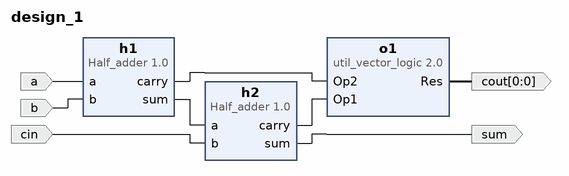
[diagram p0: block diagram of the top level]
# Vivado block design design_1, xc7a100tcsg324-1, Vivado 2024.1
create_bd_design design_1

create_bd_port -dir I a
create_bd_port -dir I b
create_bd_port -dir I cin
create_bd_port -dir O sum
create_bd_port -dir O -from 0 -to 0 cout

create_bd_cell -type ip -vlnv xilinx.com:user:Half_adder:1.0 h1
create_bd_cell -type ip -vlnv xilinx.com:user:Half_adder:1.0 h2
create_bd_cell -type ip -vlnv xilinx.com:ip:util_vector_logic:2.0 o1
set_property -dict {CONFIG.C_OPERATION or CONFIG.C_SIZE 1} [get_bd_cells o1]

# ---- connections ----

connect_bd_net -net Half_adder_0_carry [get_bd_pins h1/carry] [get_bd_pins o1/Op2]
connect_bd_net -net Half_adder_0_sum [get_bd_pins h1/sum] [get_bd_pins h2/a]
connect_bd_net -net Half_adder_1_carry [get_bd_pins h2/carry] [get_bd_pins o1/Op1]
connect_bd_net -net a_0_1 [get_bd_ports a] [get_bd_pins h1/a]
connect_bd_net -net b_0_1 [get_bd_ports b] [get_bd_pins h1/b]
connect_bd_net -net b_0_2 [get_bd_ports cin] [get_bd_pins h2/b]
connect_bd_net [get_bd_pins h2/sum] [get_bd_ports sum]
connect_bd_net -net util_vector_logic_0_Res [get_bd_pins o1/Res] [get_bd_ports cout]

validate_bd_design
save_bd_design
